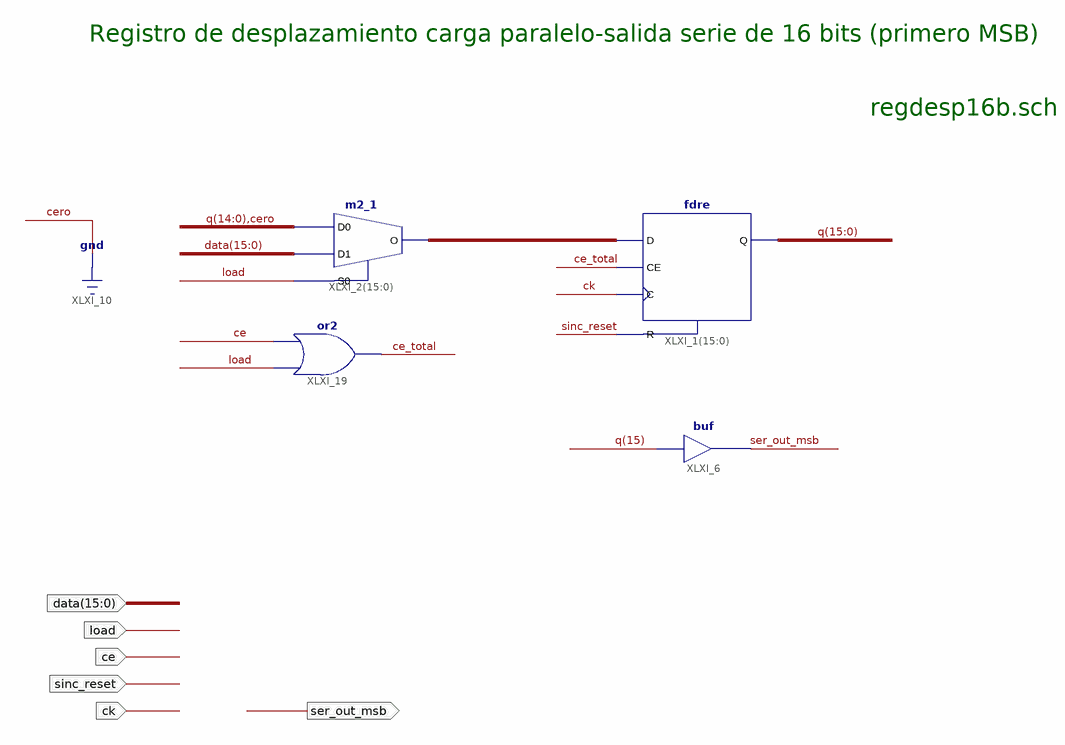
[diagram p0: schematic sheet 1]
// Xilinx ISE schematic regdesp16b.sch (spartan6) as structural Verilog: 4 symbols, 6 ports
module regdesp16b (
  input  ck,
  input  ce,
  input  sinc_reset,
  input  load,
  input  [15:0] data,
  output ser_out_msb
);

  wire ce_total;
  wire [15:0] q, XLXN_28;

  m2_1 XLXI_2[15:0] (.D0({q[14:0], 1'b0}), .D1(data), .S0(load), .O(XLXN_28));
  fdre XLXI_1[15:0] (.C(ck), .CE(ce_total), .D(XLXN_28), .R(sinc_reset), .Q(q));
  buf XLXI_6 (ser_out_msb, q[15]);
  or XLXI_19 (ce_total, load, ce);

  // Notes on the sheet:
  //   Registro de desplazamiento carga paralelo-salida serie de 16 bits (primero MSB)
  //   regdesp16b.sch
endmodule
